# Altium project KeyBored_PCB_ThomasLajoie_2025.PrjPcb
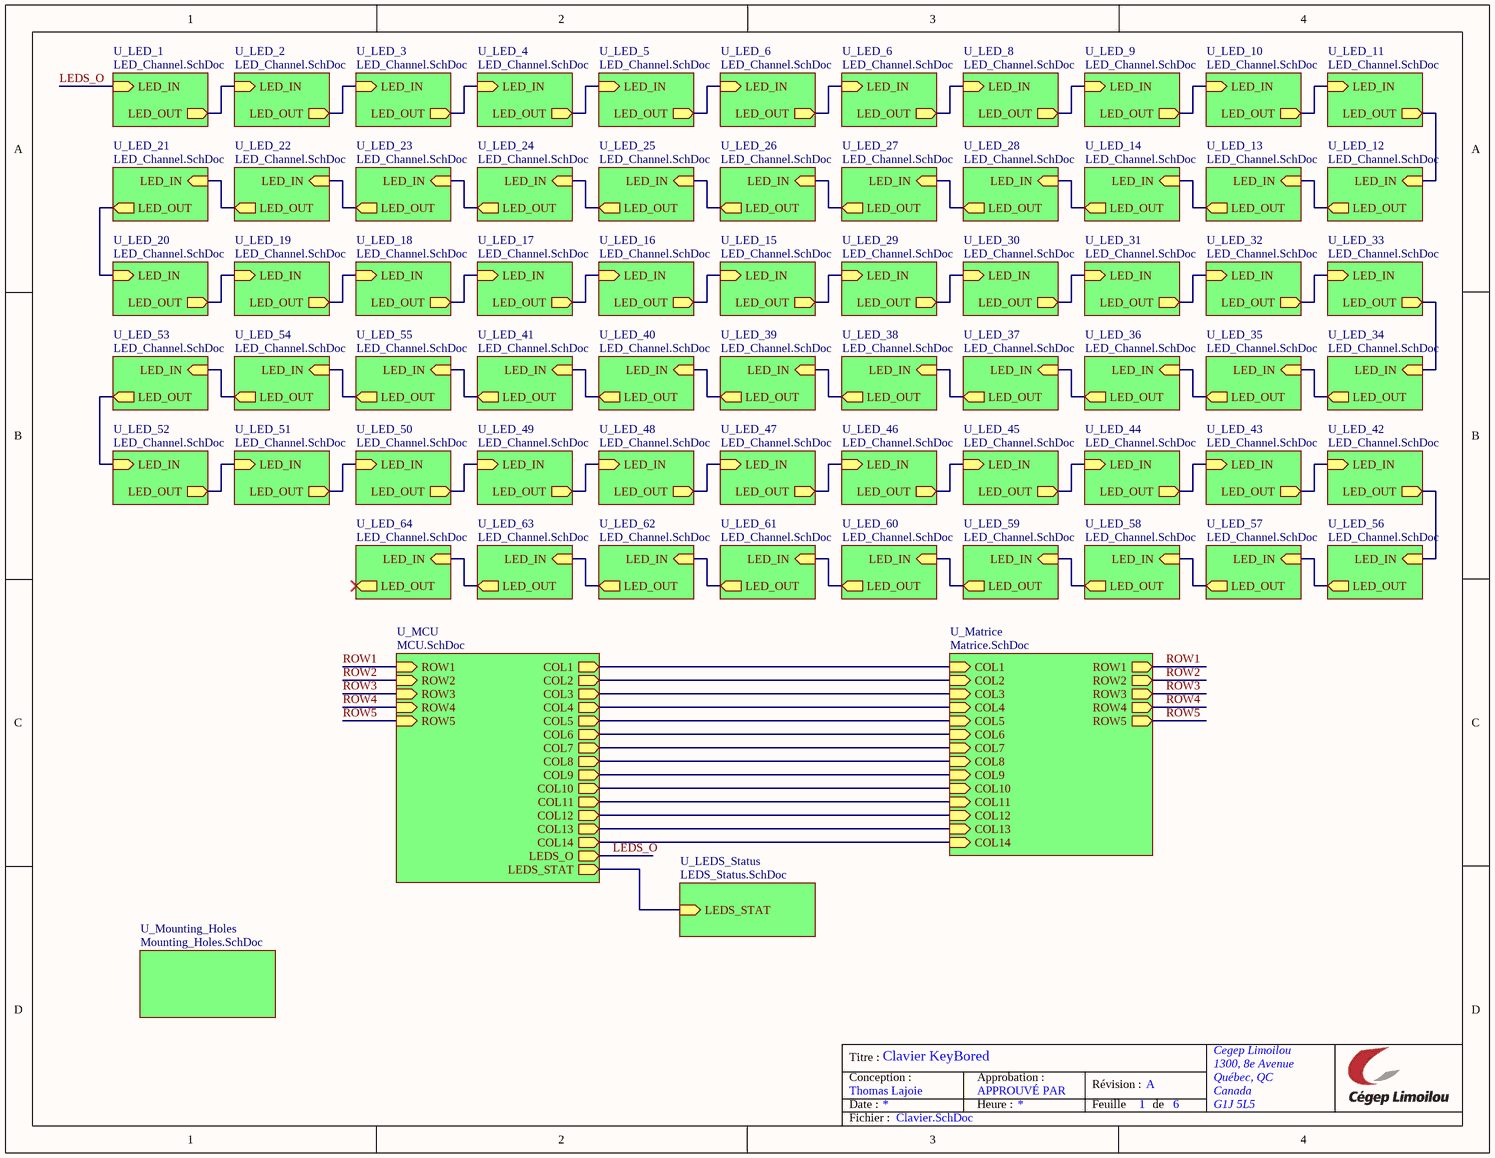
[diagram p0: Clavier.SchDoc]
Revision: Rev.C; NomDeProjet: Mon Projet
6 sheets, 312 parts. Net scope: hierarchical (ports join the sheet entries above them; power ports are global).
Board file: PCB_Clavier.PcbDoc
Sheets:
  Clavier.SchDoc
    U_LED_1 = LED_Channel.SchDoc
    U_LED_2 = LED_Channel.SchDoc
    U_LED_3 = LED_Channel.SchDoc
    U_LED_4 = LED_Channel.SchDoc
    U_LED_5 = LED_Channel.SchDoc
    U_LED_6 = LED_Channel.SchDoc
    U_LED_6 = LED_Channel.SchDoc
    U_LED_8 = LED_Channel.SchDoc
    U_LED_9 = LED_Channel.SchDoc
    U_LED_10 = LED_Channel.SchDoc
    U_LED_11 = LED_Channel.SchDoc
    U_LED_12 = LED_Channel.SchDoc
    U_LED_13 = LED_Channel.SchDoc
    U_LED_14 = LED_Channel.SchDoc
    U_LED_15 = LED_Channel.SchDoc
    U_LED_16 = LED_Channel.SchDoc
    U_LED_17 = LED_Channel.SchDoc
    U_LED_18 = LED_Channel.SchDoc
    U_LED_19 = LED_Channel.SchDoc
    U_LED_20 = LED_Channel.SchDoc
    U_LED_21 = LED_Channel.SchDoc
    U_LED_22 = LED_Channel.SchDoc
    U_LED_23 = LED_Channel.SchDoc
    U_LED_24 = LED_Channel.SchDoc
    U_LED_25 = LED_Channel.SchDoc
    U_LED_26 = LED_Channel.SchDoc
    U_LED_27 = LED_Channel.SchDoc
    U_LED_28 = LED_Channel.SchDoc
    U_LED_29 = LED_Channel.SchDoc
    U_LED_30 = LED_Channel.SchDoc
    U_LED_31 = LED_Channel.SchDoc
    U_LED_32 = LED_Channel.SchDoc
    U_LED_33 = LED_Channel.SchDoc
    U_LED_34 = LED_Channel.SchDoc
    U_LED_35 = LED_Channel.SchDoc
    U_LED_36 = LED_Channel.SchDoc
    U_LED_37 = LED_Channel.SchDoc
    U_LED_38 = LED_Channel.SchDoc
    U_LED_39 = LED_Channel.SchDoc
    U_LED_40 = LED_Channel.SchDoc
    U_LED_41 = LED_Channel.SchDoc
    U_LED_42 = LED_Channel.SchDoc
    U_LED_43 = LED_Channel.SchDoc
    U_LED_44 = LED_Channel.SchDoc
    U_LED_45 = LED_Channel.SchDoc
    U_LED_46 = LED_Channel.SchDoc
    U_LED_47 = LED_Channel.SchDoc
    U_LED_48 = LED_Channel.SchDoc
    U_LED_49 = LED_Channel.SchDoc
    U_LED_50 = LED_Channel.SchDoc
    U_LED_51 = LED_Channel.SchDoc
    U_LED_52 = LED_Channel.SchDoc
    U_LED_53 = LED_Channel.SchDoc
    U_LED_54 = LED_Channel.SchDoc
    U_LED_55 = LED_Channel.SchDoc
    U_LED_56 = LED_Channel.SchDoc
    U_LED_57 = LED_Channel.SchDoc
    U_LED_58 = LED_Channel.SchDoc
    U_LED_59 = LED_Channel.SchDoc
    U_LED_60 = LED_Channel.SchDoc
    U_LED_61 = LED_Channel.SchDoc
    U_LED_62 = LED_Channel.SchDoc
    U_LED_63 = LED_Channel.SchDoc
    U_LED_64 = LED_Channel.SchDoc
    U_Matrice = Matrice.SchDoc
    U_MCU = MCU.SchDoc
    U_LEDS_Status = LEDS_Status.SchDoc
    U_Mounting_Holes = Mounting_Holes.SchDoc

## Sheet Clavier.SchDoc: Clavier KeyBored
size Letter; ApprovedBy: APPROUVÉ PAR; Author: Thomas Lajoie; Organization: Cegep Limoilou; Address1: 1300, 8e Avenue; Address2: Québec, QC; Address3: Canada; Address4: G1J 5L5; Revision: A; SheetNumber: 1; SheetTotal: 6

### Sub-sheets
U_LED_1 = LED_Channel.SchDoc: LED_IN (in), LED_OUT (out)
U_LED_2 = LED_Channel.SchDoc: LED_IN (in), LED_OUT (out)
U_LED_3 = LED_Channel.SchDoc: LED_IN (in), LED_OUT (out)
U_LED_4 = LED_Channel.SchDoc: LED_IN (in), LED_OUT (out)
U_LED_5 = LED_Channel.SchDoc: LED_IN (in), LED_OUT (out)
U_LED_6 = LED_Channel.SchDoc: LED_IN (in), LED_OUT (out)
U_LED_6 = LED_Channel.SchDoc: LED_IN (in), LED_OUT (out)
U_LED_8 = LED_Channel.SchDoc: LED_IN (in), LED_OUT (out)
U_LED_9 = LED_Channel.SchDoc: LED_IN (in), LED_OUT (out)
U_LED_10 = LED_Channel.SchDoc: LED_IN (in), LED_OUT (out)
U_LED_11 = LED_Channel.SchDoc: LED_IN (in), LED_OUT (out)
U_LED_12 = LED_Channel.SchDoc: LED_IN (in), LED_OUT (out)
U_LED_13 = LED_Channel.SchDoc: LED_IN (in), LED_OUT (out)
U_LED_14 = LED_Channel.SchDoc: LED_IN (in), LED_OUT (out)
U_LED_15 = LED_Channel.SchDoc: LED_IN (in), LED_OUT (out)
U_LED_16 = LED_Channel.SchDoc: LED_IN (in), LED_OUT (out)
U_LED_17 = LED_Channel.SchDoc: LED_IN (in), LED_OUT (out)
U_LED_18 = LED_Channel.SchDoc: LED_IN (in), LED_OUT (out)
U_LED_19 = LED_Channel.SchDoc: LED_IN (in), LED_OUT (out)
U_LED_20 = LED_Channel.SchDoc: LED_IN (in), LED_OUT (out)
U_LED_21 = LED_Channel.SchDoc: LED_IN (in), LED_OUT (out)
U_LED_22 = LED_Channel.SchDoc: LED_IN (in), LED_OUT (out)
U_LED_23 = LED_Channel.SchDoc: LED_IN (in), LED_OUT (out)
U_LED_24 = LED_Channel.SchDoc: LED_IN (in), LED_OUT (out)
U_LED_25 = LED_Channel.SchDoc: LED_IN (in), LED_OUT (out)
U_LED_26 = LED_Channel.SchDoc: LED_IN (in), LED_OUT (out)
U_LED_27 = LED_Channel.SchDoc: LED_IN (in), LED_OUT (out)
U_LED_28 = LED_Channel.SchDoc: LED_IN (in), LED_OUT (out)
U_LED_29 = LED_Channel.SchDoc: LED_IN (in), LED_OUT (out)
U_LED_30 = LED_Channel.SchDoc: LED_IN (in), LED_OUT (out)
U_LED_31 = LED_Channel.SchDoc: LED_IN (in), LED_OUT (out)
U_LED_32 = LED_Channel.SchDoc: LED_IN (in), LED_OUT (out)
U_LED_33 = LED_Channel.SchDoc: LED_IN (in), LED_OUT (out)
U_LED_34 = LED_Channel.SchDoc: LED_IN (in), LED_OUT (out)
U_LED_35 = LED_Channel.SchDoc: LED_IN (in), LED_OUT (out)
U_LED_36 = LED_Channel.SchDoc: LED_IN (in), LED_OUT (out)
U_LED_37 = LED_Channel.SchDoc: LED_IN (in), LED_OUT (out)
U_LED_38 = LED_Channel.SchDoc: LED_IN (in), LED_OUT (out)
U_LED_39 = LED_Channel.SchDoc: LED_IN (in), LED_OUT (out)
U_LED_40 = LED_Channel.SchDoc: LED_IN (in), LED_OUT (out)
U_LED_41 = LED_Channel.SchDoc: LED_IN (in), LED_OUT (out)
U_LED_42 = LED_Channel.SchDoc: LED_IN (in), LED_OUT (out)
U_LED_43 = LED_Channel.SchDoc: LED_IN (in), LED_OUT (out)
U_LED_44 = LED_Channel.SchDoc: LED_IN (in), LED_OUT (out)
U_LED_45 = LED_Channel.SchDoc: LED_IN (in), LED_OUT (out)
U_LED_46 = LED_Channel.SchDoc: LED_IN (in), LED_OUT (out)
U_LED_47 = LED_Channel.SchDoc: LED_IN (in), LED_OUT (out)
U_LED_48 = LED_Channel.SchDoc: LED_IN (in), LED_OUT (out)
U_LED_49 = LED_Channel.SchDoc: LED_IN (in), LED_OUT (out)
U_LED_50 = LED_Channel.SchDoc: LED_IN (in), LED_OUT (out)
U_LED_51 = LED_Channel.SchDoc: LED_IN (in), LED_OUT (out)
U_LED_52 = LED_Channel.SchDoc: LED_IN (in), LED_OUT (out)
U_LED_53 = LED_Channel.SchDoc: LED_IN (in), LED_OUT (out)
U_LED_54 = LED_Channel.SchDoc: LED_IN (in), LED_OUT (out)
U_LED_55 = LED_Channel.SchDoc: LED_IN (in), LED_OUT (out)
U_LED_56 = LED_Channel.SchDoc: LED_IN (in), LED_OUT (out)
U_LED_57 = LED_Channel.SchDoc: LED_IN (in), LED_OUT (out)
U_LED_58 = LED_Channel.SchDoc: LED_IN (in), LED_OUT (out)
U_LED_59 = LED_Channel.SchDoc: LED_IN (in), LED_OUT (out)
U_LED_60 = LED_Channel.SchDoc: LED_IN (in), LED_OUT (out)
U_LED_61 = LED_Channel.SchDoc: LED_IN (in), LED_OUT (out)
U_LED_62 = LED_Channel.SchDoc: LED_IN (in), LED_OUT (out)
U_LED_63 = LED_Channel.SchDoc: LED_IN (in), LED_OUT (out)
U_LED_64 = LED_Channel.SchDoc: LED_IN (in), LED_OUT (out)
U_LEDS_Status = LEDS_Status.SchDoc: LEDS_STAT (in)
U_Matrice = Matrice.SchDoc: COL1 (in), COL2 (in), COL3 (in), COL4 (in), COL5 (in), COL6 (in), COL7 (in), COL8 (in), COL9 (in), COL10 (in), COL11 (in), COL12 (in), COL13 (in), COL14 (in), ROW1 (out), ROW2 (out), ROW3 (out), ROW4 (out), ROW5 (out)
U_MCU = MCU.SchDoc: ROW1 (in), ROW2 (in), ROW3 (in), ROW4 (in), ROW5 (in), COL1 (out), COL2 (out), COL3 (out), COL4 (out), COL5 (out), COL6 (out), COL7 (out), COL8 (out), COL9 (out), COL10 (out), COL11 (out), COL12 (out), COL13 (out), COL14 (out), LEDS_O (out), LEDS_STAT (out)
U_Mounting_Holes = Mounting_Holes.SchDoc: no entries

### Nets
LEDS_O: sheet U_LED_1/LED_IN, sheet U_MCU/LEDS_O
ROW1: sheet U_Matrice/ROW1, sheet U_MCU/ROW1
ROW2: sheet U_Matrice/ROW2, sheet U_MCU/ROW2
ROW3: sheet U_Matrice/ROW3, sheet U_MCU/ROW3
ROW4: sheet U_Matrice/ROW4, sheet U_MCU/ROW4
ROW5: sheet U_Matrice/ROW5, sheet U_MCU/ROW5
NetLED65_3: sheet U_MCU/LEDS_STAT, sheet U_LEDS_Status/LEDS_STAT
NetLED_1_4: sheet U_LED_1/LED_OUT, sheet U_LED_2/LED_IN
NetLED_2_4: sheet U_LED_2/LED_OUT, sheet U_LED_3/LED_IN
NetLED_3_4: sheet U_LED_3/LED_OUT, sheet U_LED_4/LED_IN
NetLED_4_4: sheet U_LED_4/LED_OUT, sheet U_LED_5/LED_IN
NetLED_5_4: sheet U_LED_5/LED_OUT, sheet U_LED_6/LED_IN
NetLED_6_4: sheet U_LED_6/LED_OUT, sheet U_LED_6/LED_IN
NetLED_7_4: sheet U_LED_6/LED_OUT, sheet U_LED_8/LED_IN
NetLED_8_4: sheet U_LED_8/LED_OUT, sheet U_LED_9/LED_IN
NetLED_9_4: sheet U_LED_9/LED_OUT, sheet U_LED_10/LED_IN
NetLED_10_4: sheet U_LED_10/LED_OUT, sheet U_LED_11/LED_IN
NetLED_11_4: sheet U_LED_11/LED_OUT, sheet U_LED_12/LED_IN
NetLED_13_2: sheet U_LED_12/LED_OUT, sheet U_LED_13/LED_IN
NetLED_13_4: sheet U_LED_13/LED_OUT, sheet U_LED_14/LED_IN
NetLED_14_4: sheet U_LED_14/LED_OUT, sheet U_LED_28/LED_IN
NetLED_15_2: sheet U_LED_15/LED_IN, sheet U_LED_16/LED_OUT
NetLED_15_4: sheet U_LED_15/LED_OUT, sheet U_LED_29/LED_IN
NetLED_16_2: sheet U_LED_16/LED_IN, sheet U_LED_17/LED_OUT
NetLED_17_2: sheet U_LED_17/LED_IN, sheet U_LED_18/LED_OUT
NetLED_18_2: sheet U_LED_18/LED_IN, sheet U_LED_19/LED_OUT
NetLED_19_2: sheet U_LED_19/LED_IN, sheet U_LED_20/LED_OUT
NetLED_20_2: sheet U_LED_20/LED_IN, sheet U_LED_21/LED_OUT
NetLED_21_2: sheet U_LED_21/LED_IN, sheet U_LED_22/LED_OUT
NetLED_23_2: sheet U_LED_23/LED_IN, sheet U_LED_24/LED_OUT
NetLED_23_4: sheet U_LED_22/LED_IN, sheet U_LED_23/LED_OUT
NetLED_24_2: sheet U_LED_24/LED_IN, sheet U_LED_25/LED_OUT
NetLED_25_2: sheet U_LED_25/LED_IN, sheet U_LED_26/LED_OUT
NetLED_26_2: sheet U_LED_26/LED_IN, sheet U_LED_27/LED_OUT
NetLED_27_2: sheet U_LED_27/LED_IN, sheet U_LED_28/LED_OUT
NetLED_29_4: sheet U_LED_29/LED_OUT, sheet U_LED_30/LED_IN
NetLED_30_4: sheet U_LED_30/LED_OUT, sheet U_LED_31/LED_IN
NetLED_31_4: sheet U_LED_31/LED_OUT, sheet U_LED_32/LED_IN
NetLED_32_4: sheet U_LED_32/LED_OUT, sheet U_LED_33/LED_IN
NetLED_33_4: sheet U_LED_33/LED_OUT, sheet U_LED_34/LED_IN
NetLED_34_4: sheet U_LED_34/LED_OUT, sheet U_LED_35/LED_IN
NetLED_35_4: sheet U_LED_35/LED_OUT, sheet U_LED_36/LED_IN
NetLED_36_4: sheet U_LED_36/LED_OUT, sheet U_LED_37/LED_IN
NetLED_37_4: sheet U_LED_37/LED_OUT, sheet U_LED_38/LED_IN
NetLED_38_4: sheet U_LED_38/LED_OUT, sheet U_LED_39/LED_IN
NetLED_39_4: sheet U_LED_39/LED_OUT, sheet U_LED_40/LED_IN
NetLED_40_4: sheet U_LED_40/LED_OUT, sheet U_LED_41/LED_IN
NetLED_41_4: sheet U_LED_41/LED_OUT, sheet U_LED_55/LED_IN
NetLED_42_2: sheet U_LED_42/LED_IN, sheet U_LED_43/LED_OUT
NetLED_42_4: sheet U_LED_42/LED_OUT, sheet U_LED_56/LED_IN
NetLED_43_2: sheet U_LED_43/LED_IN, sheet U_LED_44/LED_OUT
NetLED_44_2: sheet U_LED_44/LED_IN, sheet U_LED_45/LED_OUT
NetLED_45_2: sheet U_LED_45/LED_IN, sheet U_LED_46/LED_OUT
NetLED_46_2: sheet U_LED_46/LED_IN, sheet U_LED_47/LED_OUT
NetLED_47_2: sheet U_LED_47/LED_IN, sheet U_LED_48/LED_OUT
NetLED_48_2: sheet U_LED_48/LED_IN, sheet U_LED_49/LED_OUT
NetLED_49_2: sheet U_LED_49/LED_IN, sheet U_LED_50/LED_OUT
NetLED_50_2: sheet U_LED_50/LED_IN, sheet U_LED_51/LED_OUT
NetLED_51_2: sheet U_LED_51/LED_IN, sheet U_LED_52/LED_OUT
NetLED_52_2: sheet U_LED_52/LED_IN, sheet U_LED_53/LED_OUT
NetLED_53_2: sheet U_LED_53/LED_IN, sheet U_LED_54/LED_OUT
NetLED_54_2: sheet U_LED_54/LED_IN, sheet U_LED_55/LED_OUT
NetLED_56_4: sheet U_LED_56/LED_OUT, sheet U_LED_57/LED_IN
NetLED_57_4: sheet U_LED_57/LED_OUT, sheet U_LED_58/LED_IN
NetLED_58_4: sheet U_LED_58/LED_OUT, sheet U_LED_59/LED_IN
NetLED_59_4: sheet U_LED_59/LED_OUT, sheet U_LED_60/LED_IN
NetLED_60_4: sheet U_LED_60/LED_OUT, sheet U_LED_61/LED_IN
NetLED_61_4: sheet U_LED_61/LED_OUT, sheet U_LED_62/LED_IN
NetLED_62_4: sheet U_LED_62/LED_OUT, sheet U_LED_63/LED_IN
NetLED_63_4: sheet U_LED_63/LED_OUT, sheet U_LED_64/LED_IN
NetS1_2: sheet U_Matrice/COL1, sheet U_MCU/COL1
NetS2_2: sheet U_Matrice/COL2, sheet U_MCU/COL2
NetS3_2: sheet U_Matrice/COL3, sheet U_MCU/COL3
NetS4_2: sheet U_Matrice/COL4, sheet U_MCU/COL4
NetS5_2: sheet U_Matrice/COL5, sheet U_MCU/COL5
NetS6_2: sheet U_Matrice/COL6, sheet U_MCU/COL6
NetS7_2: sheet U_Matrice/COL7, sheet U_MCU/COL7
NetS8_2: sheet U_Matrice/COL8, sheet U_MCU/COL8
NetS9_2: sheet U_Matrice/COL9, sheet U_MCU/COL9
NetS10_2: sheet U_Matrice/COL10, sheet U_MCU/COL10
NetS11_2: sheet U_Matrice/COL11, sheet U_MCU/COL11
NetS12_2: sheet U_Matrice/COL12, sheet U_MCU/COL12
NetS13_2: sheet U_Matrice/COL13, sheet U_MCU/COL13
NetS14_2: sheet U_Matrice/COL14, sheet U_MCU/COL14

### Notes on the sheet
- Titre :
- Conception :
- Date :
- Approbation :
- Heure :
- Révision :
- Feuille
- de
- Fichier :

## Sheet LED_Channel.SchDoc
size Letter; Organization: Cegep Limoilou; Address1: 1300, 8e Avenue; Address2: Québec, QC; Address3: Canada; Address4: G1J 5L5; Revision: A; SheetNumber: 4; SheetTotal: 6; Conception: Thomas Lajoie; Titre: LED Channel; Modification: TL
Used 64 times, as channels U_LED_1, U_LED_2, U_LED_3, U_LED_4, U_LED_5, U_LED_6, U_LED_6, U_LED_8, U_LED_9, U_LED_10, U_LED_11, U_LED_12, U_LED_13, U_LED_14, U_LED_15, U_LED_16, U_LED_17, U_LED_18, U_LED_19, U_LED_20, U_LED_21, U_LED_22, U_LED_23, U_LED_24, U_LED_25, U_LED_26, U_LED_27, U_LED_28, U_LED_29, U_LED_30, U_LED_31, U_LED_32, U_LED_33, U_LED_34, U_LED_35, U_LED_36, U_LED_37, U_LED_38, U_LED_39, U_LED_40, U_LED_41, U_LED_42, U_LED_43, U_LED_44, U_LED_45, U_LED_46, U_LED_47, U_LED_48, U_LED_49, U_LED_50, U_LED_51, U_LED_52, U_LED_53, U_LED_54, U_LED_55, U_LED_56, U_LED_57, U_LED_58, U_LED_59, U_LED_60, U_LED_61, U_LED_62, U_LED_63, U_LED_64. Parts and nets are listed once, with the designators drawn on the sheet.
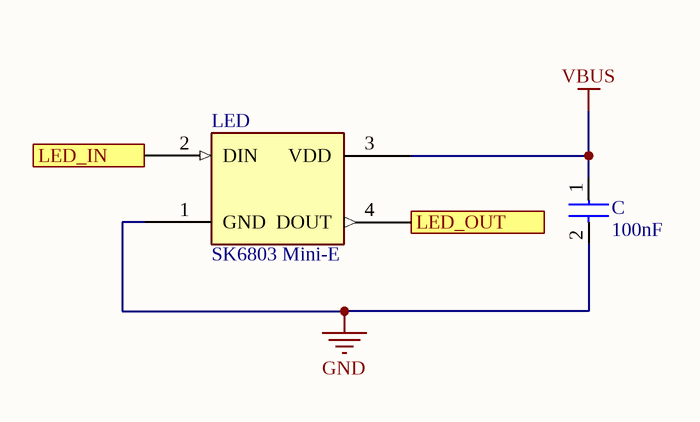
[diagram p1: LED_Channel.SchDoc]

### Parts
C  100nF  [CL10B104KA8NNNC]
LED  SK6803 Mini-E  [SK6803 MINI-E]

### Ports
LED_IN (in), LED_OUT (out)

### Nets
GND: C.2 LED.1(GND)
VBUS: C.1 LED.3(VDD)
LED_IN: LED.2(DIN) ; port LED_IN
LED_OUT: LED.4(DOUT) ; port LED_OUT

### Channels
U_LED_1: designators end in _1; ports LED_IN=LEDS_O LED_OUT=NetLED_1_4
U_LED_2: designators end in _2; ports LED_IN=NetLED_1_4 LED_OUT=NetLED_2_4
U_LED_3: designators end in _3; ports LED_IN=NetLED_2_4 LED_OUT=NetLED_3_4
U_LED_4: designators end in _4; ports LED_IN=NetLED_3_4 LED_OUT=NetLED_4_4
U_LED_5: designators end in _5; ports LED_IN=NetLED_4_4 LED_OUT=NetLED_5_4
U_LED_6: designators end in _6; ports LED_IN=NetLED_5_4 LED_OUT=NetLED_6_4
U_LED_6: designators end in _7; ports LED_IN=NetLED_6_4 LED_OUT=NetLED_7_4
U_LED_8: designators end in _8; ports LED_IN=NetLED_7_4 LED_OUT=NetLED_8_4
U_LED_9: designators end in _9; ports LED_IN=NetLED_8_4 LED_OUT=NetLED_9_4
U_LED_10: designators end in _10; ports LED_IN=NetLED_9_4 LED_OUT=NetLED_10_4
U_LED_11: designators end in _11; ports LED_IN=NetLED_10_4 LED_OUT=NetLED_11_4
U_LED_12: designators C=C_22 LED=LED_122; ports LED_IN=NetLED_11_4 LED_OUT=NetLED_13_2
U_LED_13: designators end in _13; ports LED_IN=NetLED_13_2 LED_OUT=NetLED_13_4
U_LED_14: designators end in _14; ports LED_IN=NetLED_13_4 LED_OUT=NetLED_14_4
U_LED_15: designators end in _15; ports LED_IN=NetLED_15_2 LED_OUT=NetLED_15_4
U_LED_16: designators end in _16; ports LED_IN=NetLED_16_2 LED_OUT=NetLED_15_2
U_LED_17: designators end in _17; ports LED_IN=NetLED_17_2 LED_OUT=NetLED_16_2
U_LED_18: designators end in _18; ports LED_IN=NetLED_18_2 LED_OUT=NetLED_17_2
U_LED_19: designators end in _19; ports LED_IN=NetLED_19_2 LED_OUT=NetLED_18_2
U_LED_20: designators end in _20; ports LED_IN=NetLED_20_2 LED_OUT=NetLED_19_2
U_LED_21: designators end in _21; ports LED_IN=NetLED_21_2 LED_OUT=NetLED_20_2
U_LED_22: designators end in _121; ports LED_IN=NetLED_23_4 LED_OUT=NetLED_21_2
U_LED_23: designators end in _23; ports LED_IN=NetLED_23_2 LED_OUT=NetLED_23_4
U_LED_24: designators end in _24; ports LED_IN=NetLED_24_2 LED_OUT=NetLED_23_2
U_LED_25: designators end in _25; ports LED_IN=NetLED_25_2 LED_OUT=NetLED_24_2
U_LED_26: designators end in _26; ports LED_IN=NetLED_26_2 LED_OUT=NetLED_25_2
U_LED_27: designators end in _27; ports LED_IN=NetLED_27_2 LED_OUT=NetLED_26_2
U_LED_28: designators end in _28; ports LED_IN=NetLED_14_4 LED_OUT=NetLED_27_2
U_LED_29: designators end in _29; ports LED_IN=NetLED_15_4 LED_OUT=NetLED_29_4
U_LED_30: designators end in _30; ports LED_IN=NetLED_29_4 LED_OUT=NetLED_30_4
U_LED_31: designators end in _31; ports LED_IN=NetLED_30_4 LED_OUT=NetLED_31_4
U_LED_32: designators end in _32; ports LED_IN=NetLED_31_4 LED_OUT=NetLED_32_4
U_LED_33: designators end in _33; ports LED_IN=NetLED_32_4 LED_OUT=NetLED_33_4
U_LED_34: designators end in _34; ports LED_IN=NetLED_33_4 LED_OUT=NetLED_34_4
U_LED_35: designators end in _35; ports LED_IN=NetLED_34_4 LED_OUT=NetLED_35_4
U_LED_36: designators end in _36; ports LED_IN=NetLED_35_4 LED_OUT=NetLED_36_4
U_LED_37: designators end in _37; ports LED_IN=NetLED_36_4 LED_OUT=NetLED_37_4
U_LED_38: designators end in _38; ports LED_IN=NetLED_37_4 LED_OUT=NetLED_38_4
U_LED_39: designators end in _39; ports LED_IN=NetLED_38_4 LED_OUT=NetLED_39_4
U_LED_40: designators end in _40; ports LED_IN=NetLED_39_4 LED_OUT=NetLED_40_4
U_LED_41: designators end in _41; ports LED_IN=NetLED_40_4 LED_OUT=NetLED_41_4
U_LED_42: designators end in _42; ports LED_IN=NetLED_42_2 LED_OUT=NetLED_42_4
U_LED_43: designators end in _43; ports LED_IN=NetLED_43_2 LED_OUT=NetLED_42_2
U_LED_44: designators end in _44; ports LED_IN=NetLED_44_2 LED_OUT=NetLED_43_2
U_LED_45: designators end in _45; ports LED_IN=NetLED_45_2 LED_OUT=NetLED_44_2
U_LED_46: designators end in _46; ports LED_IN=NetLED_46_2 LED_OUT=NetLED_45_2
U_LED_47: designators end in _47; ports LED_IN=NetLED_47_2 LED_OUT=NetLED_46_2
U_LED_48: designators end in _48; ports LED_IN=NetLED_48_2 LED_OUT=NetLED_47_2
U_LED_49: designators end in _49; ports LED_IN=NetLED_49_2 LED_OUT=NetLED_48_2
U_LED_50: designators end in _50; ports LED_IN=NetLED_50_2 LED_OUT=NetLED_49_2
U_LED_51: designators end in _51; ports LED_IN=NetLED_51_2 LED_OUT=NetLED_50_2
U_LED_52: designators end in _52; ports LED_IN=NetLED_52_2 LED_OUT=NetLED_51_2
U_LED_53: designators end in _53; ports LED_IN=NetLED_53_2 LED_OUT=NetLED_52_2
U_LED_54: designators end in _54; ports LED_IN=NetLED_54_2 LED_OUT=NetLED_53_2
U_LED_55: designators end in _55; ports LED_IN=NetLED_41_4 LED_OUT=NetLED_54_2
U_LED_56: designators end in _56; ports LED_IN=NetLED_42_4 LED_OUT=NetLED_56_4
U_LED_57: designators end in _57; ports LED_IN=NetLED_56_4 LED_OUT=NetLED_57_4
U_LED_58: designators end in _58; ports LED_IN=NetLED_57_4 LED_OUT=NetLED_58_4
U_LED_59: designators end in _59; ports LED_IN=NetLED_58_4 LED_OUT=NetLED_59_4
U_LED_60: designators end in _60; ports LED_IN=NetLED_59_4 LED_OUT=NetLED_60_4
U_LED_61: designators end in _61; ports LED_IN=NetLED_60_4 LED_OUT=NetLED_61_4
U_LED_62: designators end in _62; ports LED_IN=NetLED_61_4 LED_OUT=NetLED_62_4
U_LED_63: designators end in _63; ports LED_IN=NetLED_62_4 LED_OUT=NetLED_63_4
U_LED_64: designators end in _64; ports LED_IN=NetLED_63_4 LED_OUT=NetLED_64_4

### Notes on the sheet
- Titre :
- Conception :
- Date :
- Modification :
- Heure :
- Révision :
- Feuille
- de
- Fichier :

### Library data of the parts
C = CAP NP: LCSC Part #: C1590

## Sheet Matrice.SchDoc
size Letter; Organization: Cegep Limoilou; Address1: 1300, 8e Avenue; Address2: Québec, QC; Address3: Canada; Address4: G1J 5L5; Revision: A; SheetNumber: 3; SheetTotal: 6; Conception: Thomas Lajoie; Titre: Matrice de switches; Modification: TL
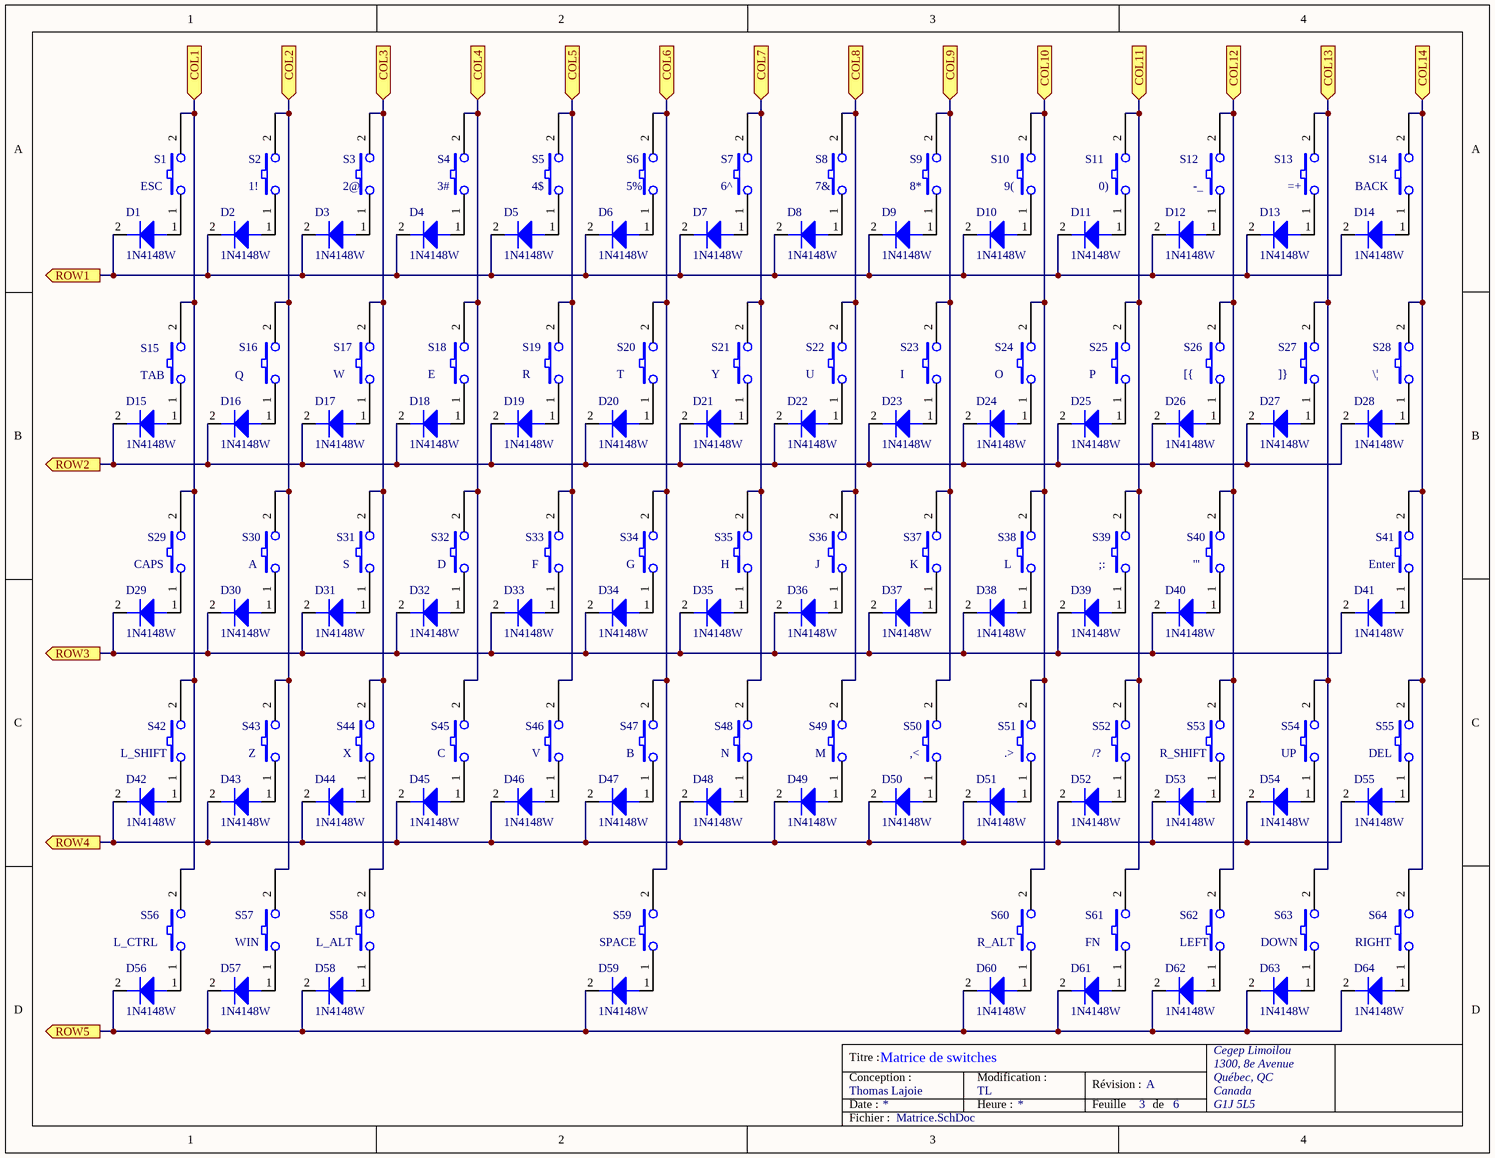
[diagram p2: Matrice.SchDoc]

### Parts
D1  1N4148W  [1N4148W(SOD123)]
D2  1N4148W  [1N4148W(SOD123)]
D3  1N4148W  [1N4148W(SOD123)]
D4  1N4148W  [1N4148W(SOD123)]
D5  1N4148W  [1N4148W(SOD123)]
D6  1N4148W  [1N4148W(SOD123)]
D7  1N4148W  [1N4148W(SOD123)]
D8  1N4148W  [1N4148W(SOD123)]
D9  1N4148W  [1N4148W(SOD123)]
D10  1N4148W  [1N4148W(SOD123)]
D11  1N4148W  [1N4148W(SOD123)]
D12  1N4148W  [1N4148W(SOD123)]
D13  1N4148W  [1N4148W(SOD123)]
D14  1N4148W  [1N4148W(SOD123)]
D15  1N4148W  [1N4148W(SOD123)]
D16  1N4148W  [1N4148W(SOD123)]
D17  1N4148W  [1N4148W(SOD123)]
D18  1N4148W  [1N4148W(SOD123)]
D19  1N4148W  [1N4148W(SOD123)]
D20  1N4148W  [1N4148W(SOD123)]
D21  1N4148W  [1N4148W(SOD123)]
D22  1N4148W  [1N4148W(SOD123)]
D23  1N4148W  [1N4148W(SOD123)]
D24  1N4148W  [1N4148W(SOD123)]
D25  1N4148W  [1N4148W(SOD123)]
D26  1N4148W  [1N4148W(SOD123)]
D27  1N4148W  [1N4148W(SOD123)]
D28  1N4148W  [1N4148W(SOD123)]
D29  1N4148W  [1N4148W(SOD123)]
D30  1N4148W  [1N4148W(SOD123)]
D31  1N4148W  [1N4148W(SOD123)]
D32  1N4148W  [1N4148W(SOD123)]
D33  1N4148W  [1N4148W(SOD123)]
D34  1N4148W  [1N4148W(SOD123)]
D35  1N4148W  [1N4148W(SOD123)]
D36  1N4148W  [1N4148W(SOD123)]
D37  1N4148W  [1N4148W(SOD123)]
D38  1N4148W  [1N4148W(SOD123)]
D39  1N4148W  [1N4148W(SOD123)]
D40  1N4148W  [1N4148W(SOD123)]
D41  1N4148W  [1N4148W(SOD123)]
D42  1N4148W  [1N4148W(SOD123)]
D43  1N4148W  [1N4148W(SOD123)]
D44  1N4148W  [1N4148W(SOD123)]
D45  1N4148W  [1N4148W(SOD123)]
D46  1N4148W  [1N4148W(SOD123)]
D47  1N4148W  [1N4148W(SOD123)]
D48  1N4148W  [1N4148W(SOD123)]
D49  1N4148W  [1N4148W(SOD123)]
D50  1N4148W  [1N4148W(SOD123)]
D51  1N4148W  [1N4148W(SOD123)]
D52  1N4148W  [1N4148W(SOD123)]
D53  1N4148W  [1N4148W(SOD123)]
D54  1N4148W  [1N4148W(SOD123)]
D55  1N4148W  [1N4148W(SOD123)]
D56  1N4148W  [1N4148W(SOD123)]
D57  1N4148W  [1N4148W(SOD123)]
D58  1N4148W  [1N4148W(SOD123)]
D59  1N4148W  [1N4148W(SOD123)]
D60  1N4148W  [1N4148W(SOD123)]
D61  1N4148W  [1N4148W(SOD123)]
D62  1N4148W  [1N4148W(SOD123)]
D63  1N4148W  [1N4148W(SOD123)]
D64  1N4148W  [1N4148W(SOD123)]
S1  ESC  [GATERON_LOWPROFILE_HOTSWAP_SOCKET]
S2  1!  [GATERON_LOWPROFILE_HOTSWAP_SOCKET]
S3  2@  [GATERON_LOWPROFILE_HOTSWAP_SOCKET]
S4  3#  [GATERON_LOWPROFILE_HOTSWAP_SOCKET]
S5  4$  [GATERON_LOWPROFILE_HOTSWAP_SOCKET]
S6  5%  [GATERON_LOWPROFILE_HOTSWAP_SOCKET]
S7  6^  [GATERON_LOWPROFILE_HOTSWAP_SOCKET]
S8  7&  [GATERON_LOWPROFILE_HOTSWAP_SOCKET]
S9  8*  [GATERON_LOWPROFILE_HOTSWAP_SOCKET]
S10  9(  [GATERON_LOWPROFILE_HOTSWAP_SOCKET]
S11  0)  [GATERON_LOWPROFILE_HOTSWAP_SOCKET]
S12  -_  [GATERON_LOWPROFILE_HOTSWAP_SOCKET]
S13  (no value)  [GATERON_LOWPROFILE_HOTSWAP_SOCKET]
S14  BACK  [GATERON_LOWPROFILE_HOTSWAP_SOCKET]
S15  TAB  [GATERON_LOWPROFILE_HOTSWAP_SOCKET]
S16  Q  [GATERON_LOWPROFILE_HOTSWAP_SOCKET]
S17  W  [GATERON_LOWPROFILE_HOTSWAP_SOCKET]
S18  E  [GATERON_LOWPROFILE_HOTSWAP_SOCKET]
S19  R  [GATERON_LOWPROFILE_HOTSWAP_SOCKET]
S20  T  [GATERON_LOWPROFILE_HOTSWAP_SOCKET]
S21  Y  [GATERON_LOWPROFILE_HOTSWAP_SOCKET]
S22  U  [GATERON_LOWPROFILE_HOTSWAP_SOCKET]
S23  I  [GATERON_LOWPROFILE_HOTSWAP_SOCKET]
S24  O  [GATERON_LOWPROFILE_HOTSWAP_SOCKET]
S25  P  [GATERON_LOWPROFILE_HOTSWAP_SOCKET]
S26  [{  [GATERON_LOWPROFILE_HOTSWAP_SOCKET]
S27  ]}  [GATERON_LOWPROFILE_HOTSWAP_SOCKET]
S28  \|  [GATERON_LOWPROFILE_HOTSWAP_SOCKET]
S29  CAPS  [GATERON_LOWPROFILE_HOTSWAP_SOCKET]
S30  A  [GATERON_LOWPROFILE_HOTSWAP_SOCKET]
S31  S  [GATERON_LOWPROFILE_HOTSWAP_SOCKET]
S32  D  [GATERON_LOWPROFILE_HOTSWAP_SOCKET]
S33  F  [GATERON_LOWPROFILE_HOTSWAP_SOCKET]
S34  G  [GATERON_LOWPROFILE_HOTSWAP_SOCKET]
S35  H  [GATERON_LOWPROFILE_HOTSWAP_SOCKET]
S36  J  [GATERON_LOWPROFILE_HOTSWAP_SOCKET]
S37  K  [GATERON_LOWPROFILE_HOTSWAP_SOCKET]
S38  L  [GATERON_LOWPROFILE_HOTSWAP_SOCKET]
S39  ;:  [GATERON_LOWPROFILE_HOTSWAP_SOCKET]
S40  '"  [GATERON_LOWPROFILE_HOTSWAP_SOCKET]
S41  Enter  [GATERON_LOWPROFILE_HOTSWAP_SOCKET]
S42  L_SHIFT  [GATERON_LOWPROFILE_HOTSWAP_SOCKET]
S43  Z  [GATERON_LOWPROFILE_HOTSWAP_SOCKET]
S44  X  [GATERON_LOWPROFILE_HOTSWAP_SOCKET]
S45  C  [GATERON_LOWPROFILE_HOTSWAP_SOCKET]
S46  V  [GATERON_LOWPROFILE_HOTSWAP_SOCKET]
S47  B  [GATERON_LOWPROFILE_HOTSWAP_SOCKET]
S48  N  [GATERON_LOWPROFILE_HOTSWAP_SOCKET]
S49  M  [GATERON_LOWPROFILE_HOTSWAP_SOCKET]
S50  ,<  [GATERON_LOWPROFILE_HOTSWAP_SOCKET]
S51  .>  [GATERON_LOWPROFILE_HOTSWAP_SOCKET]
S52  /?  [GATERON_LOWPROFILE_HOTSWAP_SOCKET]
S53  R_SHIFT  [GATERON_LOWPROFILE_HOTSWAP_SOCKET]
S54  UP  [GATERON_LOWPROFILE_HOTSWAP_SOCKET]
S55  DEL  [GATERON_LOWPROFILE_HOTSWAP_SOCKET]
S56  L_CTRL  [GATERON_LOWPROFILE_HOTSWAP_SOCKET]
S57  WIN  [GATERON_LOWPROFILE_HOTSWAP_SOCKET]
S58  L_ALT  [GATERON_LOWPROFILE_HOTSWAP_SOCKET]
S59  SPACE  [GATERON_LOWPROFILE_HOTSWAP_SOCKET]
S60  R_ALT  [GATERON_LOWPROFILE_HOTSWAP_SOCKET]
S61  FN  [GATERON_LOWPROFILE_HOTSWAP_SOCKET]
S62  LEFT  [GATERON_LOWPROFILE_HOTSWAP_SOCKET]
S63  DOWN  [GATERON_LOWPROFILE_HOTSWAP_SOCKET]
S64  RIGHT  [GATERON_LOWPROFILE_HOTSWAP_SOCKET]

### Ports
COL1 (in), COL2 (in), COL3 (in), COL4 (in), COL5 (in), COL6 (in), COL7 (in), COL8 (in), COL9 (in), COL10 (in), COL11 (in), COL12 (in), COL13 (in), COL14 (in), ROW1 (out), ROW2 (out), ROW3 (out), ROW4 (out), ROW5 (out)

### Nets
ROW1: D1.2(CATHODE) D2.2(CATHODE) D3.2(CATHODE) D4.2(CATHODE) D5.2(CATHODE) D6.2(CATHODE) D7.2(CATHODE) D8.2(CATHODE) D9.2(CATHODE) D10.2(CATHODE) D11.2(CATHODE) D12.2(CATHODE) D13.2(CATHODE) D14.2(CATHODE) ; port ROW1
ROW2: D15.2(CATHODE) D16.2(CATHODE) D17.2(CATHODE) D18.2(CATHODE) D19.2(CATHODE) D20.2(CATHODE) D21.2(CATHODE) D22.2(CATHODE) D23.2(CATHODE) D24.2(CATHODE) D25.2(CATHODE) D26.2(CATHODE) D27.2(CATHODE) D28.2(CATHODE) ; port ROW2
ROW3: D29.2(CATHODE) D30.2(CATHODE) D31.2(CATHODE) D32.2(CATHODE) D33.2(CATHODE) D34.2(CATHODE) D35.2(CATHODE) D36.2(CATHODE) D37.2(CATHODE) D38.2(CATHODE) D39.2(CATHODE) D40.2(CATHODE) D41.2(CATHODE) ; port ROW3
ROW4: D42.2(CATHODE) D43.2(CATHODE) D44.2(CATHODE) D45.2(CATHODE) D46.2(CATHODE) D47.2(CATHODE) D48.2(CATHODE) D49.2(CATHODE) D50.2(CATHODE) D51.2(CATHODE) D52.2(CATHODE) D53.2(CATHODE) D54.2(CATHODE) D55.2(CATHODE) ; port ROW4
ROW5: D56.2(CATHODE) D57.2(CATHODE) D58.2(CATHODE) D59.2(CATHODE) D60.2(CATHODE) D61.2(CATHODE) D62.2(CATHODE) D63.2(CATHODE) D64.2(CATHODE) ; port ROW5
NetD1_1: D1.1(ANODE) S1.1
NetD2_1: D2.1(ANODE) S2.1
NetD3_1: D3.1(ANODE) S3.1
NetD4_1: D4.1(ANODE) S4.1
NetD5_1: D5.1(ANODE) S5.1
NetD6_1: D6.1(ANODE) S6.1
NetD7_1: D7.1(ANODE) S7.1
NetD8_1: D8.1(ANODE) S8.1
NetD9_1: D9.1(ANODE) S9.1
NetD10_1: D10.1(ANODE) S10.1
NetD11_1: D11.1(ANODE) S11.1
NetD12_1: D12.1(ANODE) S12.1
NetD13_1: D13.1(ANODE) S13.1
NetD14_1: D14.1(ANODE) S14.1
NetD15_1: D15.1(ANODE) S15.1
NetD16_1: D16.1(ANODE) S16.1
NetD17_1: D17.1(ANODE) S17.1
NetD18_1: D18.1(ANODE) S18.1
NetD19_1: D19.1(ANODE) S19.1
NetD20_1: D20.1(ANODE) S20.1
NetD21_1: D21.1(ANODE) S21.1
NetD22_1: D22.1(ANODE) S22.1
NetD23_1: D23.1(ANODE) S23.1
NetD24_1: D24.1(ANODE) S24.1
NetD25_1: D25.1(ANODE) S25.1
NetD26_1: D26.1(ANODE) S26.1
NetD27_1: D27.1(ANODE) S27.1
NetD28_1: D28.1(ANODE) S28.1
NetD29_1: D29.1(ANODE) S29.1
NetD30_1: D30.1(ANODE) S30.1
NetD31_1: D31.1(ANODE) S31.1
NetD32_1: D32.1(ANODE) S32.1
NetD33_1: D33.1(ANODE) S33.1
NetD34_1: D34.1(ANODE) S34.1
NetD35_1: D35.1(ANODE) S35.1
NetD36_1: D36.1(ANODE) S36.1
NetD37_1: D37.1(ANODE) S37.1
NetD38_1: D38.1(ANODE) S38.1
NetD39_1: D39.1(ANODE) S39.1
NetD40_1: D40.1(ANODE) S40.1
NetD41_1: D41.1(ANODE) S41.1
NetD42_1: D42.1(ANODE) S42.1
NetD43_1: D43.1(ANODE) S43.1
NetD44_1: D44.1(ANODE) S44.1
NetD45_1: D45.1(ANODE) S45.1
NetD46_1: D46.1(ANODE) S46.1
NetD47_1: D47.1(ANODE) S47.1
NetD48_1: D48.1(ANODE) S48.1
NetD49_1: D49.1(ANODE) S49.1
NetD50_1: D50.1(ANODE) S50.1
NetD51_1: D51.1(ANODE) S51.1
NetD52_1: D52.1(ANODE) S52.1
NetD53_1: D53.1(ANODE) S53.1
NetD54_1: D54.1(ANODE) S54.1
NetD55_1: D55.1(ANODE) S55.1
NetD56_1: D56.1(ANODE) S56.1
NetD57_1: D57.1(ANODE) S57.1
NetD58_1: D58.1(ANODE) S58.1
NetD59_1: D59.1(ANODE) S59.1
NetD60_1: D60.1(ANODE) S60.1
NetD61_1: D61.1(ANODE) S61.1
NetD62_1: D62.1(ANODE) S62.1
NetD63_1: D63.1(ANODE) S63.1
NetD64_1: D64.1(ANODE) S64.1
NetS1_2: S1.2 S15.2 S29.2 S42.2 S56.2 ; port COL1
NetS2_2: S2.2 S16.2 S30.2 S43.2 S57.2 ; port COL2
NetS3_2: S3.2 S17.2 S31.2 S44.2 S58.2 ; port COL3
NetS4_2: S4.2 S18.2 S32.2 S45.2 ; port COL4
NetS5_2: S5.2 S19.2 S33.2 S46.2 ; port COL5
NetS6_2: S6.2 S20.2 S34.2 S47.2 S59.2 ; port COL6
NetS7_2: S7.2 S21.2 S35.2 S48.2 ; port COL7
NetS8_2: S8.2 S22.2 S36.2 S49.2 ; port COL8
NetS9_2: S9.2 S23.2 S37.2 S50.2 ; port COL9
NetS10_2: S10.2 S24.2 S38.2 S51.2 S60.2 ; port COL10
NetS11_2: S11.2 S25.2 S39.2 S52.2 S61.2 ; port COL11
NetS12_2: S12.2 S26.2 S40.2 S53.2 S62.2 ; port COL12
NetS13_2: S13.2 S27.2 S54.2 S63.2 ; port COL13
NetS14_2: S14.2 S28.2 S41.2 S55.2 S64.2 ; port COL14

### Notes on the sheet
- Titre :
- Conception :
- Date :
- Modification :
- Heure :
- Révision :
- Feuille
- de
- Fichier :

### Library data of the parts
D1-D64 = DIODE: LCSC Part #: C2099
S1-S64 = SW PUSHBUTTON

## Sheet MCU.SchDoc: MCU
size Letter; ApprovedBy: APPROUVÉ PAR; Author: Thomas Lajoie; Organization: Cegep Limoilou; Address1: 1300, 8e Avenue; Address2: Québec, QC; Address3: Canada; Address4: G1J 5L5; Revision: A; SheetNumber: 2; SheetTotal: 6
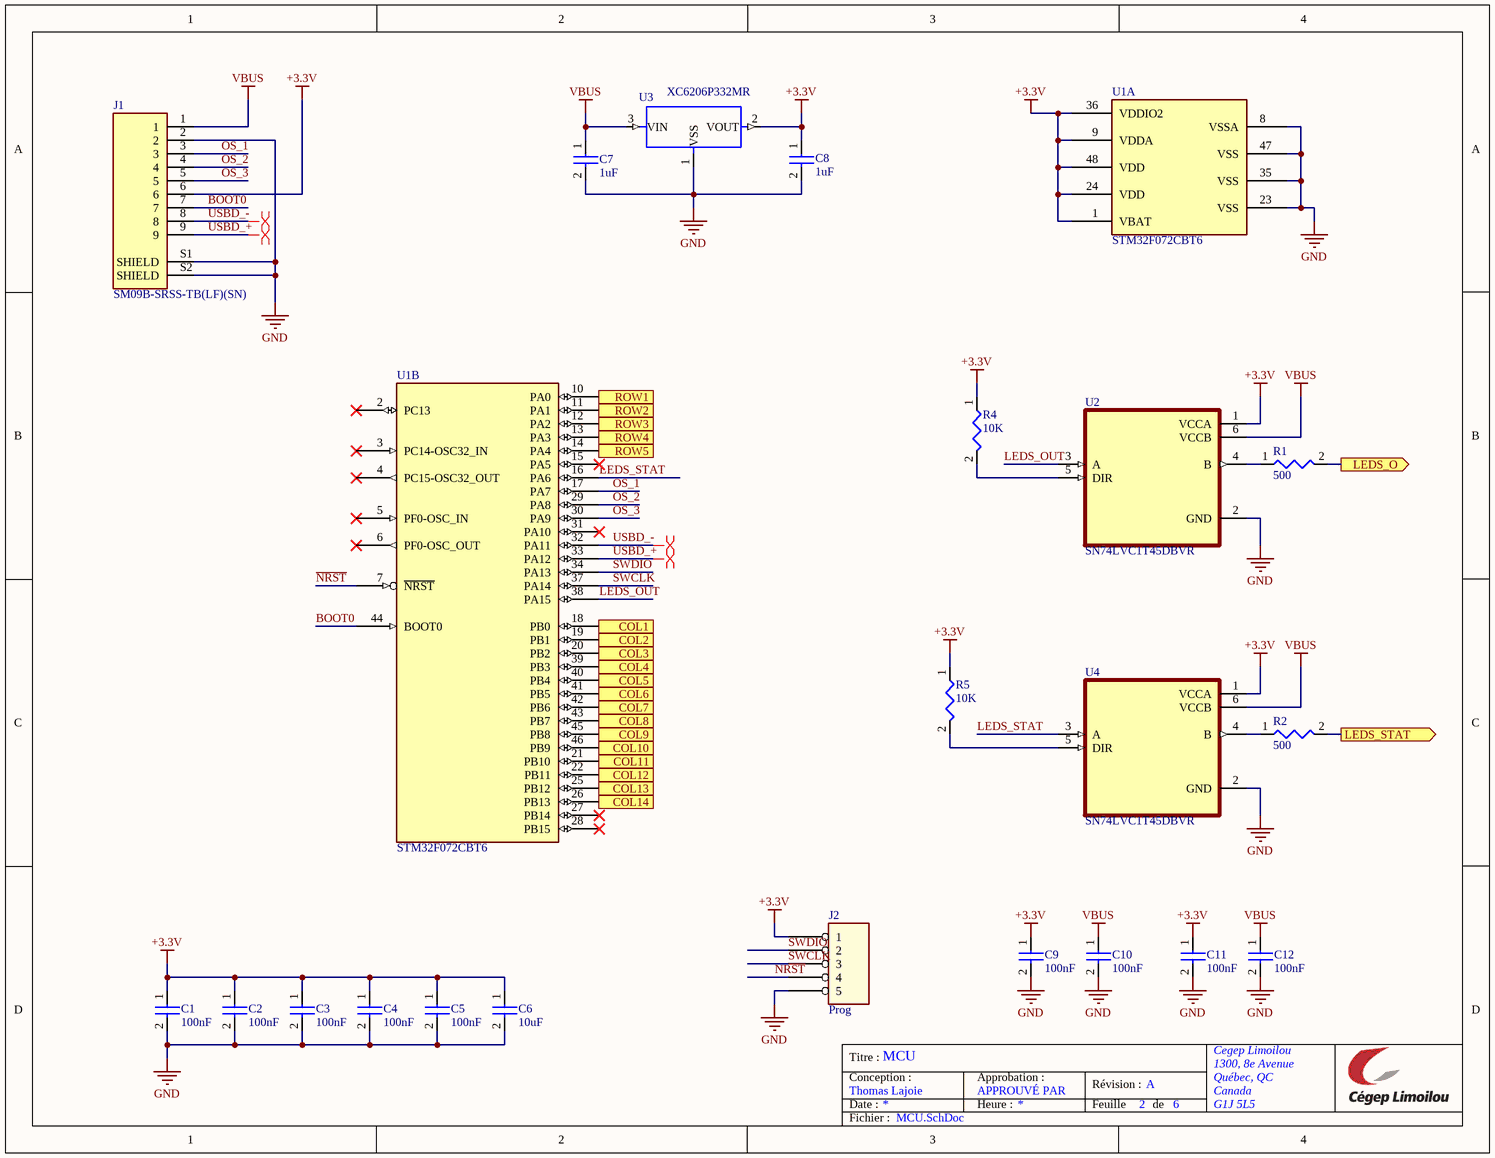
[diagram p3: MCU.SchDoc]

### Parts
C1  100nF  [CL10B104KA8NNNC]
C2  100nF  [CL10B104KA8NNNC]
C3  100nF  [CL10B104KA8NNNC]
C4  100nF  [CL10B104KA8NNNC]
C5  100nF  [CL10B104KA8NNNC]
C6  10uF  [CL10A106KP8NNNC]
C7  1uF  [CL10A105KA8NNNC]
C8  1uF  [CL10A105KA8NNNC]
C9  100nF  [CL10B104KA8NNNC]
C10  100nF  [CL10B104KA8NNNC]
C11  100nF  [CL10B104KA8NNNC]
C12  100nF  [CL10B104KA8NNNC]
J1  SM09B-SRSS-TB(LF)(SN)  [JST_SM09B-SRSS-TB(LF)(SN)]
J2  Prog  [TE_5-146280-5]
R1  500  [0603WAF5100T5E]
R2  500  [0603WAF5100T5E]
R4  10K  [0603WAJ0103T5E]
R5  10K  [0603WAJ0103T5E]
U1  STM32F072CBT6  [QFP50P900X900X160-48N]  (parts A,B of 2)
U2  SN74LVC1T45DBVR  [SOT95P280X145-6N]
U3  XC6206P332MR  [SOT-23]
U4  SN74LVC1T45DBVR  [SOT95P280X145-6N]

### Ports
COL1 (out), COL2 (out), COL3 (out), COL4 (out), COL5 (out), COL6 (out), COL7 (out), COL8 (out), COL9 (out), COL10 (out), COL11 (out), COL12 (out), COL13 (out), COL14 (out), LEDS_O (out), LEDS_STAT (out), ROW1 (in), ROW2 (in), ROW3 (in), ROW4 (in), ROW5 (in)

### Nets
+3.3V: C1.1 C2.1 C3.1 C4.1 C5.1 C6.1 C8.1 C9.1 C11.1 J1.6 J2.1 R4.1 R5.1 U1.1(VBAT) U1.9(VDDA) U1.24(VDD) U1.36(VDDIO2) U1.48(VDD) U2.1(VCCA) U3.2(VOUT) U4.1(VCCA)
GND: C1.2 C2.2 C3.2 C4.2 C5.2 C6.2 C7.2 C8.2 C9.2 C10.2 C11.2 C12.2 J1.2 J1.S1(SHIELD) J1.S2(SHIELD) J2.5 U1.8(VSSA) U1.23(VSS) U1.35(VSS) U1.47(VSS) U2.2(GND) U3.1(VSS) U4.2(GND)
VBUS: C7.1 C10.1 C12.1 J1.1 U2.6(VCCB) U3.3(VIN) U4.6(VCCB)
~{NRST}: J2.4 U1.7(~{NRST})
BOOT0: J1.7 U1.44(BOOT0)
LEDS_O: R1.2 ; port LEDS_O
LEDS_OUT: U1.38(PA15) U2.3(A)
LEDS_STAT: U1.16(PA6) U4.3(A)
OS_1: J1.3 U1.17(PA7)
OS_2: J1.4 U1.29(PA8)
OS_3: J1.5 U1.30(PA9)
ROW1: U1.10(PA0) ; port ROW1
ROW2: U1.11(PA1) ; port ROW2
ROW3: U1.12(PA2) ; port ROW3
ROW4: U1.13(PA3) ; port ROW4
ROW5: U1.14(PA4) ; port ROW5
SWCLK: J2.3 U1.37(PA14)
SWDIO: J2.2 U1.34(PA13)
USBD_+: J1.9 U1.33(PA12)
USBD_-: J1.8 U1.32(PA11)
NetLED65_3: R2.2 ; port LEDS_STAT
NetR1_1: R1.1 U2.4(B)
NetR2_1: R2.1 U4.4(B)
NetR4_2: R4.2 U2.5(DIR)
NetR5_2: R5.2 U4.5(DIR)
NetS1_2: U1.18(PB0) ; port COL1
NetS2_2: U1.19(PB1) ; port COL2
NetS3_2: U1.20(PB2) ; port COL3
NetS4_2: U1.39(PB3) ; port COL4
NetS5_2: U1.40(PB4) ; port COL5
NetS6_2: U1.41(PB5) ; port COL6
NetS7_2: U1.42(PB6) ; port COL7
NetS8_2: U1.43(PB7) ; port COL8
NetS9_2: U1.45(PB8) ; port COL9
NetS10_2: U1.46(PB9) ; port COL10
NetS11_2: U1.21(PB10) ; port COL11
NetS12_2: U1.22(PB11) ; port COL12
NetS13_2: U1.25(PB12) ; port COL13
NetS14_2: U1.26(PB13) ; port COL14

Not connected (* = marked no-connect by the designer): U1 2(PC13)* 3(PC14-OSC32_IN)* 4(PC15-OSC32_OUT)* 5(PF0-OSC_IN)* 6(PF0-OSC_OUT)* 15(PA5)* 27(PB14)* 28(PB15)* 31(PA10)*

### Layout directives
differential pair: USBD_+, USBD_-

### Notes on the sheet
- Titre :
- Conception :
- Date :
- Approbation :
- Heure :
- Révision :
- Feuille
- de
- Fichier :

### Library data of the parts
C1-C12 = CAP NP
  C1: ComponentLink1Description: New link; ComponentLink1URL: *; LCSC Part #: C1590
  C2-C5 C9-C12: LCSC Part #: C1590
  C6: LCSC Part #: C19702
  C7 C8: LCSC Part #: C5673
J1 = SM09B-SRSS-TB(LF)(SN): Connector Header Surface Mount, Right Angle 9 position 0.039 (1.00mm); MF: JST Sales America Inc.; SnapEDA_Link: https://www.snapeda.com/parts/SM09B-SRSS-TB(LF)(SN)/JST/view-part/?ref=snap; Package: None; Value: *; MP: SM09B-SRSS-TB(LF)(SN); Check_prices: https://www.snapeda.com/parts/SM09B-SRSS-TB(LF)(SN)/JST/view-part/?ref=eda; LCSC Part #: C160408
J2 = HEADER 5
R1 R2 R4 R5 = R
  R1 R2: LCSC Part #: C23193
  R4 R5: LCSC Part #: C15401
U2 U4 = SN74LVC1T45DBVR: Single-Bit Dual-Supply Bus Transceiver with Configurable Voltage-Level Shifting and 3-State Outputs 6-SOT-23 -40 to 85; MF: Texas Instruments; Package: SOT-23-6 Texas Instruments; Purchase-URL: https://pricing.snapeda.com/search/part/SN74LVC1T45DBVR/?ref=eda; MP: SN74LVC1T45DBVR; Availability: Good; SnapEDA_Link: https://www.snapeda.com/parts/SN74LVC1T45DBVR/Texas%20Instruments/view-part/106485/?ref=snap; Price: None; LCSC Part #: C7843
  U2: Check_prices: https://www.snapeda.com/parts/SN74LVC1T45DBVR/Texas%20Instruments/view-part/106485/?ref=eda
U3 = PMIC-LDO-XC6206P332MR-G(SOT23): Linear Voltage Regulator IC Positive Fixed 1 Output 200mA SOT-23; MF: Torex; Check_prices: https://www.snapeda.com/parts/XC6206P332MR-G/Torex/view-part/?ref=eda; Purchase-URL: https://pricing.snapeda.com/search/part/XC6206P332MR-G/?ref=eda; Value: *; Availability: In Stock; Package: SOT-23-3 Torex; SnapEDA_Link: https://www.snapeda.com/parts/XC6206P332MR-G/Torex/view-part/?ref=snap; MP: XC6206P332MR-G; Price: None; LCSC Part #: C5446

## Sheet LEDS_Status.SchDoc
size Letter; Organization: Cegep Limoilou; Address1: 1300, 8e Avenue; Address2: Québec, QC; Address3: Canada; Address4: G1J 5L5; Revision: A; SheetNumber: 5; SheetTotal: 6; Conception: Thomas Lajoie; Titre: LEDs status; Modification: TL
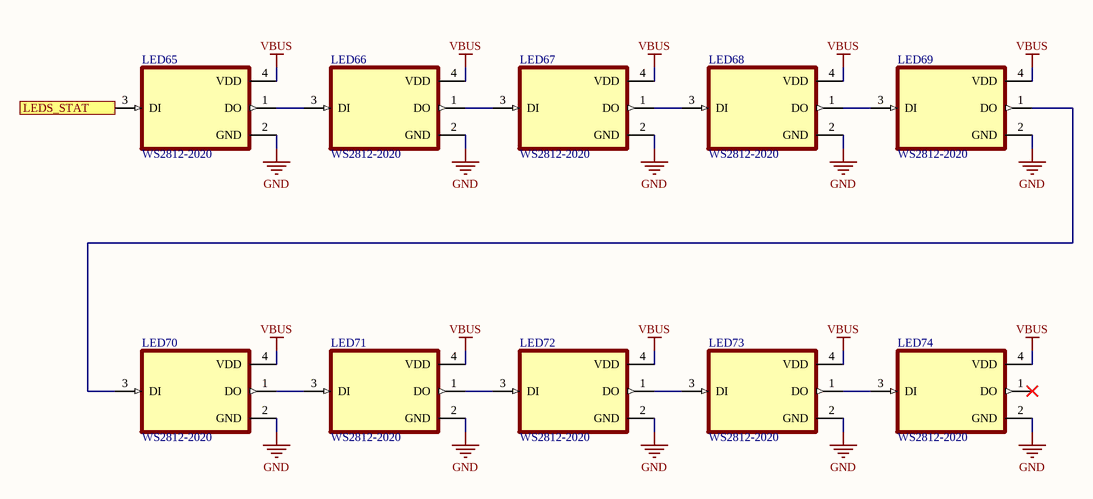
[diagram p4: LEDS_Status.SchDoc]

### Parts
LED65  WS2812-2020  [LED_WS2812-2020]
LED66  WS2812-2020  [LED_WS2812-2020]
LED67  WS2812-2020  [LED_WS2812-2020]
LED68  WS2812-2020  [LED_WS2812-2020]
LED69  WS2812-2020  [LED_WS2812-2020]
LED70  WS2812-2020  [LED_WS2812-2020]
LED71  WS2812-2020  [LED_WS2812-2020]
LED72  WS2812-2020  [LED_WS2812-2020]
LED73  WS2812-2020  [LED_WS2812-2020]
LED74  WS2812-2020  [LED_WS2812-2020]

### Ports
LEDS_STAT (in)

### Nets
GND: LED65.2(GND) LED66.2(GND) LED67.2(GND) LED68.2(GND) LED69.2(GND) LED70.2(GND) LED71.2(GND) LED72.2(GND) LED73.2(GND) LED74.2(GND)
VBUS: LED65.4(VDD) LED66.4(VDD) LED67.4(VDD) LED68.4(VDD) LED69.4(VDD) LED70.4(VDD) LED71.4(VDD) LED72.4(VDD) LED73.4(VDD) LED74.4(VDD)
NetLED65_1: LED65.1(DO) LED66.3(DI)
NetLED65_3: LED65.3(DI) ; port LEDS_STAT
NetLED66_1: LED66.1(DO) LED67.3(DI)
NetLED67_1: LED67.1(DO) LED68.3(DI)
NetLED68_1: LED68.1(DO) LED69.3(DI)
NetLED69_1: LED69.1(DO) LED70.3(DI)
NetLED70_1: LED70.1(DO) LED71.3(DI)
NetLED71_1: LED71.1(DO) LED72.3(DI)
NetLED72_1: LED72.1(DO) LED73.3(DI)
NetLED73_1: LED73.1(DO) LED74.3(DI)

Not connected (* = marked no-connect by the designer): LED74 1(DO)*

### Notes on the sheet
- Titre :
- Conception :
- Date :
- Modification :
- Heure :
- Révision :
- Feuille
- de
- Fichier :

### Library data of the parts
LED65-LED74 = WS2812-2020: Intelligent control LED light source, SMD-4; MF: Worldsemi; MP: WS2812-2020; Availability: Not in stock; Package: Package; SnapEDA_Link: https://www.snapeda.com/parts/WS2812-2020/Worldsemi/view-part/?ref=snap; Check_prices: https://www.snapeda.com/parts/WS2812-2020/Worldsemi/view-part/?ref=eda; Value: *; Price: None

## Sheet Mounting_Holes.SchDoc
size Letter; Organization: Cegep Limoilou; Address1: 1300, 8e Avenue; Address2: Québec, QC; Address3: Canada; Address4: G1J 5L5; Revision: A; SheetNumber: 6; SheetTotal: 6; Conception: Thomas Lajoie; Titre: Trous de montage; Modification: TL
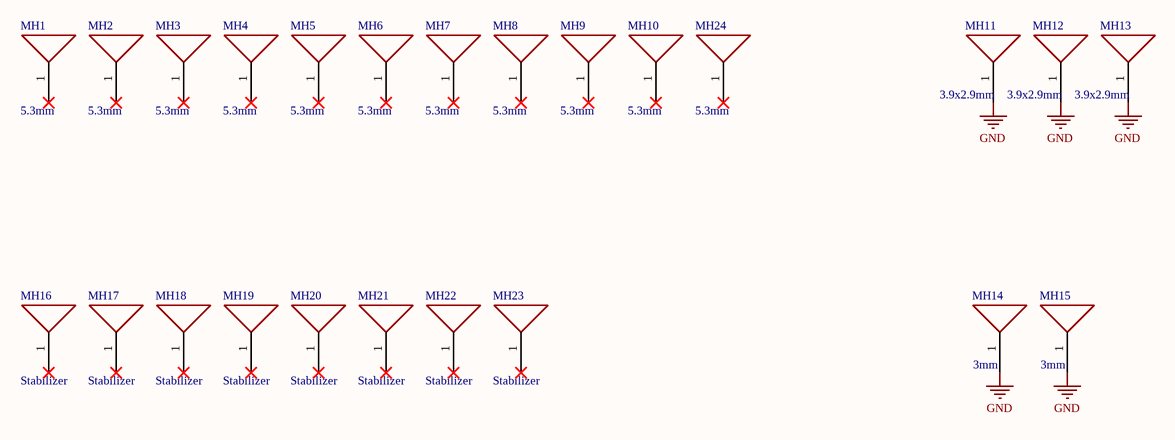
[diagram p5: Mounting_Holes.SchDoc]

### Parts
MH1  5.3mm  [MTH_ROUND_5.35D]
MH2  5.3mm  [MTH_ROUND_5.35D]
MH3  5.3mm  [MTH_ROUND_5.35D]
MH4  5.3mm  [MTH_ROUND_5.35D]
MH5  5.3mm  [MTH_ROUND_5.35D]
MH6  5.3mm  [MTH_ROUND_5.35D]
MH7  5.3mm  [MTH_ROUND_5.35D]
MH8  5.3mm  [MTH_ROUND_5.35D]
MH9  5.3mm  [MTH_ROUND_5.35D]
MH10  5.3mm  [MTH_ROUND_5.35D]
MH11  3.9x2.9mm  [MTH_OBLONG_3.9x2.9_PL]
MH12  3.9x2.9mm  [MTH_OBLONG_3.9x2.9_PL]
MH13  3.9x2.9mm  [MTH_OBLONG_3.9x2.9_PL]
MH14  3mm  [MTH_ROUND_3D_PL]
MH15  3mm  [MTH_ROUND_3D_PL]
MH16  Stabilizer  [STABILIZERS_HOLE]
MH17  Stabilizer  [STABILIZERS_HOLE]
MH18  Stabilizer  [STABILIZERS_HOLE]
MH19  Stabilizer  [STABILIZERS_HOLE]
MH20  Stabilizer  [STABILIZERS_HOLE]
MH21  Stabilizer  [STABILIZERS_HOLE]
MH22  Stabilizer  [STABILIZERS_HOLE]
MH23  Stabilizer  [STABILIZERS_HOLE]
MH24  5.3mm  [MTH_ROUND_5.35D]

### Nets
GND: MH11.1 MH12.1 MH13.1 MH14.1 MH15.1

Not connected (* = marked no-connect by the designer): MH1 1*; MH2 1*; MH3 1*; MH4 1*; MH5 1*; MH6 1*; MH7 1*; MH8 1*; MH9 1*; MH10 1*; MH16 1*; MH17 1*; MH18 1*; MH19 1*; MH20 1*; MH21 1*; MH22 1*; MH23 1*; MH24 1*

### Notes on the sheet
- Titre :
- Conception :
- Date :
- Modification :
- Heure :
- Révision :
- Feuille
- de
- Fichier :

### Library data of the parts
MH1-MH24 = Mounting Hole

## Nets that join several sheets
GND: U_LED_1 (C_1.2 LED_1.1), U_LED_2 (C_2.2 LED_2.1), U_LED_3 (C_3.2 LED_3.1), U_LED_4 (C_4.2 LED_4.1), U_LED_5 (C_5.2 LED_5.1), U_LED_6 (C_6.2 LED_6.1), U_LED_6 (C_7.2 LED_7.1), U_LED_8 (C_8.2 LED_8.1), U_LED_9 (C_9.2 LED_9.1), U_LED_10 (C_10.2 LED_10.1), U_LED_11 (C_11.2 LED_11.1), U_LED_12 (C_22.2 LED_122.1), U_LED_13 (C_13.2 LED_13.1), U_LED_14 (C_14.2 LED_14.1), U_LED_15 (C_15.2 LED_15.1), U_LED_16 (C_16.2 LED_16.1), U_LED_17 (C_17.2 LED_17.1), U_LED_18 (C_18.2 LED_18.1), U_LED_19 (C_19.2 LED_19.1), U_LED_20 (C_20.2 LED_20.1), U_LED_21 (C_21.2 LED_21.1), U_LED_22 (C_121.2 LED_121.1), U_LED_23 (C_23.2 LED_23.1), U_LED_24 (C_24.2 LED_24.1), U_LED_25 (C_25.2 LED_25.1), U_LED_26 (C_26.2 LED_26.1), U_LED_27 (C_27.2 LED_27.1), U_LED_28 (C_28.2 LED_28.1), U_LED_29 (C_29.2 LED_29.1), U_LED_30 (C_30.2 LED_30.1), U_LED_31 (C_31.2 LED_31.1), U_LED_32 (C_32.2 LED_32.1), U_LED_33 (C_33.2 LED_33.1), U_LED_34 (C_34.2 LED_34.1), U_LED_35 (C_35.2 LED_35.1), U_LED_36 (C_36.2 LED_36.1), U_LED_37 (C_37.2 LED_37.1), U_LED_38 (C_38.2 LED_38.1), U_LED_39 (C_39.2 LED_39.1), U_LED_40 (C_40.2 LED_40.1), U_LED_41 (C_41.2 LED_41.1), U_LED_42 (C_42.2 LED_42.1), U_LED_43 (C_43.2 LED_43.1), U_LED_44 (C_44.2 LED_44.1), U_LED_45 (C_45.2 LED_45.1), U_LED_46 (C_46.2 LED_46.1), U_LED_47 (C_47.2 LED_47.1), U_LED_48 (C_48.2 LED_48.1), U_LED_49 (C_49.2 LED_49.1), U_LED_50 (C_50.2 LED_50.1), U_LED_51 (C_51.2 LED_51.1), U_LED_52 (C_52.2 LED_52.1), U_LED_53 (C_53.2 LED_53.1), U_LED_54 (C_54.2 LED_54.1), U_LED_55 (C_55.2 LED_55.1), U_LED_56 (C_56.2 LED_56.1), U_LED_57 (C_57.2 LED_57.1), U_LED_58 (C_58.2 LED_58.1), U_LED_59 (C_59.2 LED_59.1), U_LED_60 (C_60.2 LED_60.1), U_LED_61 (C_61.2 LED_61.1), U_LED_62 (C_62.2 LED_62.1), U_LED_63 (C_63.2 LED_63.1), U_LED_64 (C_64.2 LED_64.1), MCU (23 pins), LEDS_Status (10 pins), Mounting_Holes (5 pins)
VBUS: U_LED_1 (C_1.1 LED_1.3), U_LED_2 (C_2.1 LED_2.3), U_LED_3 (C_3.1 LED_3.3), U_LED_4 (C_4.1 LED_4.3), U_LED_5 (C_5.1 LED_5.3), U_LED_6 (C_6.1 LED_6.3), U_LED_6 (C_7.1 LED_7.3), U_LED_8 (C_8.1 LED_8.3), U_LED_9 (C_9.1 LED_9.3), U_LED_10 (C_10.1 LED_10.3), U_LED_11 (C_11.1 LED_11.3), U_LED_12 (C_22.1 LED_122.3), U_LED_13 (C_13.1 LED_13.3), U_LED_14 (C_14.1 LED_14.3), U_LED_15 (C_15.1 LED_15.3), U_LED_16 (C_16.1 LED_16.3), U_LED_17 (C_17.1 LED_17.3), U_LED_18 (C_18.1 LED_18.3), U_LED_19 (C_19.1 LED_19.3), U_LED_20 (C_20.1 LED_20.3), U_LED_21 (C_21.1 LED_21.3), U_LED_22 (C_121.1 LED_121.3), U_LED_23 (C_23.1 LED_23.3), U_LED_24 (C_24.1 LED_24.3), U_LED_25 (C_25.1 LED_25.3), U_LED_26 (C_26.1 LED_26.3), U_LED_27 (C_27.1 LED_27.3), U_LED_28 (C_28.1 LED_28.3), U_LED_29 (C_29.1 LED_29.3), U_LED_30 (C_30.1 LED_30.3), U_LED_31 (C_31.1 LED_31.3), U_LED_32 (C_32.1 LED_32.3), U_LED_33 (C_33.1 LED_33.3), U_LED_34 (C_34.1 LED_34.3), U_LED_35 (C_35.1 LED_35.3), U_LED_36 (C_36.1 LED_36.3), U_LED_37 (C_37.1 LED_37.3), U_LED_38 (C_38.1 LED_38.3), U_LED_39 (C_39.1 LED_39.3), U_LED_40 (C_40.1 LED_40.3), U_LED_41 (C_41.1 LED_41.3), U_LED_42 (C_42.1 LED_42.3), U_LED_43 (C_43.1 LED_43.3), U_LED_44 (C_44.1 LED_44.3), U_LED_45 (C_45.1 LED_45.3), U_LED_46 (C_46.1 LED_46.3), U_LED_47 (C_47.1 LED_47.3), U_LED_48 (C_48.1 LED_48.3), U_LED_49 (C_49.1 LED_49.3), U_LED_50 (C_50.1 LED_50.3), U_LED_51 (C_51.1 LED_51.3), U_LED_52 (C_52.1 LED_52.3), U_LED_53 (C_53.1 LED_53.3), U_LED_54 (C_54.1 LED_54.3), U_LED_55 (C_55.1 LED_55.3), U_LED_56 (C_56.1 LED_56.3), U_LED_57 (C_57.1 LED_57.3), U_LED_58 (C_58.1 LED_58.3), U_LED_59 (C_59.1 LED_59.3), U_LED_60 (C_60.1 LED_60.3), U_LED_61 (C_61.1 LED_61.3), U_LED_62 (C_62.1 LED_62.3), U_LED_63 (C_63.1 LED_63.3), U_LED_64 (C_64.1 LED_64.3), MCU (7 pins), LEDS_Status (10 pins)
LEDS_O: U_LED_1 (LED_1.2), MCU (R1.2)
NetLED65_3: MCU (R2.2), LEDS_Status (LED65.3)
NetLED_1_4: U_LED_1 (LED_1.4), U_LED_2 (LED_2.2)
NetLED_2_4: U_LED_2 (LED_2.4), U_LED_3 (LED_3.2)
NetLED_3_4: U_LED_3 (LED_3.4), U_LED_4 (LED_4.2)
NetLED_4_4: U_LED_4 (LED_4.4), U_LED_5 (LED_5.2)
NetLED_5_4: U_LED_5 (LED_5.4), U_LED_6 (LED_6.2)
NetLED_6_4: U_LED_6 (LED_6.4), U_LED_6 (LED_7.2)
NetLED_7_4: U_LED_6 (LED_7.4), U_LED_8 (LED_8.2)
NetLED_8_4: U_LED_8 (LED_8.4), U_LED_9 (LED_9.2)
NetLED_9_4: U_LED_9 (LED_9.4), U_LED_10 (LED_10.2)
NetLED_10_4: U_LED_10 (LED_10.4), U_LED_11 (LED_11.2)
NetLED_11_4: U_LED_11 (LED_11.4), U_LED_12 (LED_122.2)
NetLED_13_2: U_LED_12 (LED_122.4), U_LED_13 (LED_13.2)
NetLED_13_4: U_LED_13 (LED_13.4), U_LED_14 (LED_14.2)
NetLED_14_4: U_LED_14 (LED_14.4), U_LED_28 (LED_28.2)
NetLED_15_2: U_LED_15 (LED_15.2), U_LED_16 (LED_16.4)
NetLED_15_4: U_LED_15 (LED_15.4), U_LED_29 (LED_29.2)
NetLED_16_2: U_LED_16 (LED_16.2), U_LED_17 (LED_17.4)
NetLED_17_2: U_LED_17 (LED_17.2), U_LED_18 (LED_18.4)
NetLED_18_2: U_LED_18 (LED_18.2), U_LED_19 (LED_19.4)
NetLED_19_2: U_LED_19 (LED_19.2), U_LED_20 (LED_20.4)
NetLED_20_2: U_LED_20 (LED_20.2), U_LED_21 (LED_21.4)
NetLED_21_2: U_LED_21 (LED_21.2), U_LED_22 (LED_121.4)
NetLED_23_2: U_LED_23 (LED_23.2), U_LED_24 (LED_24.4)
NetLED_23_4: U_LED_22 (LED_121.2), U_LED_23 (LED_23.4)
NetLED_24_2: U_LED_24 (LED_24.2), U_LED_25 (LED_25.4)
NetLED_25_2: U_LED_25 (LED_25.2), U_LED_26 (LED_26.4)
NetLED_26_2: U_LED_26 (LED_26.2), U_LED_27 (LED_27.4)
NetLED_27_2: U_LED_27 (LED_27.2), U_LED_28 (LED_28.4)
NetLED_29_4: U_LED_29 (LED_29.4), U_LED_30 (LED_30.2)
NetLED_30_4: U_LED_30 (LED_30.4), U_LED_31 (LED_31.2)
NetLED_31_4: U_LED_31 (LED_31.4), U_LED_32 (LED_32.2)
NetLED_32_4: U_LED_32 (LED_32.4), U_LED_33 (LED_33.2)
NetLED_33_4: U_LED_33 (LED_33.4), U_LED_34 (LED_34.2)
NetLED_34_4: U_LED_34 (LED_34.4), U_LED_35 (LED_35.2)
NetLED_35_4: U_LED_35 (LED_35.4), U_LED_36 (LED_36.2)
NetLED_36_4: U_LED_36 (LED_36.4), U_LED_37 (LED_37.2)
NetLED_37_4: U_LED_37 (LED_37.4), U_LED_38 (LED_38.2)
NetLED_38_4: U_LED_38 (LED_38.4), U_LED_39 (LED_39.2)
NetLED_39_4: U_LED_39 (LED_39.4), U_LED_40 (LED_40.2)
NetLED_40_4: U_LED_40 (LED_40.4), U_LED_41 (LED_41.2)
NetLED_41_4: U_LED_41 (LED_41.4), U_LED_55 (LED_55.2)
NetLED_42_2: U_LED_42 (LED_42.2), U_LED_43 (LED_43.4)
NetLED_42_4: U_LED_42 (LED_42.4), U_LED_56 (LED_56.2)
NetLED_43_2: U_LED_43 (LED_43.2), U_LED_44 (LED_44.4)
NetLED_44_2: U_LED_44 (LED_44.2), U_LED_45 (LED_45.4)
NetLED_45_2: U_LED_45 (LED_45.2), U_LED_46 (LED_46.4)
NetLED_46_2: U_LED_46 (LED_46.2), U_LED_47 (LED_47.4)
NetLED_47_2: U_LED_47 (LED_47.2), U_LED_48 (LED_48.4)
NetLED_48_2: U_LED_48 (LED_48.2), U_LED_49 (LED_49.4)
NetLED_49_2: U_LED_49 (LED_49.2), U_LED_50 (LED_50.4)
NetLED_50_2: U_LED_50 (LED_50.2), U_LED_51 (LED_51.4)
NetLED_51_2: U_LED_51 (LED_51.2), U_LED_52 (LED_52.4)
NetLED_52_2: U_LED_52 (LED_52.2), U_LED_53 (LED_53.4)
NetLED_53_2: U_LED_53 (LED_53.2), U_LED_54 (LED_54.4)
NetLED_54_2: U_LED_54 (LED_54.2), U_LED_55 (LED_55.4)
NetLED_56_4: U_LED_56 (LED_56.4), U_LED_57 (LED_57.2)
NetLED_57_4: U_LED_57 (LED_57.4), U_LED_58 (LED_58.2)
NetLED_58_4: U_LED_58 (LED_58.4), U_LED_59 (LED_59.2)
NetLED_59_4: U_LED_59 (LED_59.4), U_LED_60 (LED_60.2)
NetLED_60_4: U_LED_60 (LED_60.4), U_LED_61 (LED_61.2)
NetLED_61_4: U_LED_61 (LED_61.4), U_LED_62 (LED_62.2)
NetLED_62_4: U_LED_62 (LED_62.4), U_LED_63 (LED_63.2)
NetLED_63_4: U_LED_63 (LED_63.4), U_LED_64 (LED_64.2)
NetS1_2: Matrice (5 pins), MCU (U1.18)
NetS2_2: Matrice (5 pins), MCU (U1.19)
NetS3_2: Matrice (5 pins), MCU (U1.20)
NetS4_2: Matrice (S4.2 S18.2 S32.2 S45.2), MCU (U1.39)
NetS5_2: Matrice (S5.2 S19.2 S33.2 S46.2), MCU (U1.40)
NetS6_2: Matrice (5 pins), MCU (U1.41)
NetS7_2: Matrice (S7.2 S21.2 S35.2 S48.2), MCU (U1.42)
NetS8_2: Matrice (S8.2 S22.2 S36.2 S49.2), MCU (U1.43)
NetS9_2: Matrice (S9.2 S23.2 S37.2 S50.2), MCU (U1.45)
NetS10_2: Matrice (5 pins), MCU (U1.46)
NetS11_2: Matrice (5 pins), MCU (U1.21)
NetS12_2: Matrice (5 pins), MCU (U1.22)
NetS13_2: Matrice (S13.2 S27.2 S54.2 S63.2), MCU (U1.25)
NetS14_2: Matrice (5 pins), MCU (U1.26)
ROW1: Matrice (14 pins), MCU (U1.10)
ROW2: Matrice (14 pins), MCU (U1.11)
ROW3: Matrice (13 pins), MCU (U1.12)
ROW4: Matrice (14 pins), MCU (U1.13)
ROW5: Matrice (9 pins), MCU (U1.14)